# EAGLE schematic AVRI2CIO_V0_2_LEVEL0 (EAGLE 6.5.0)
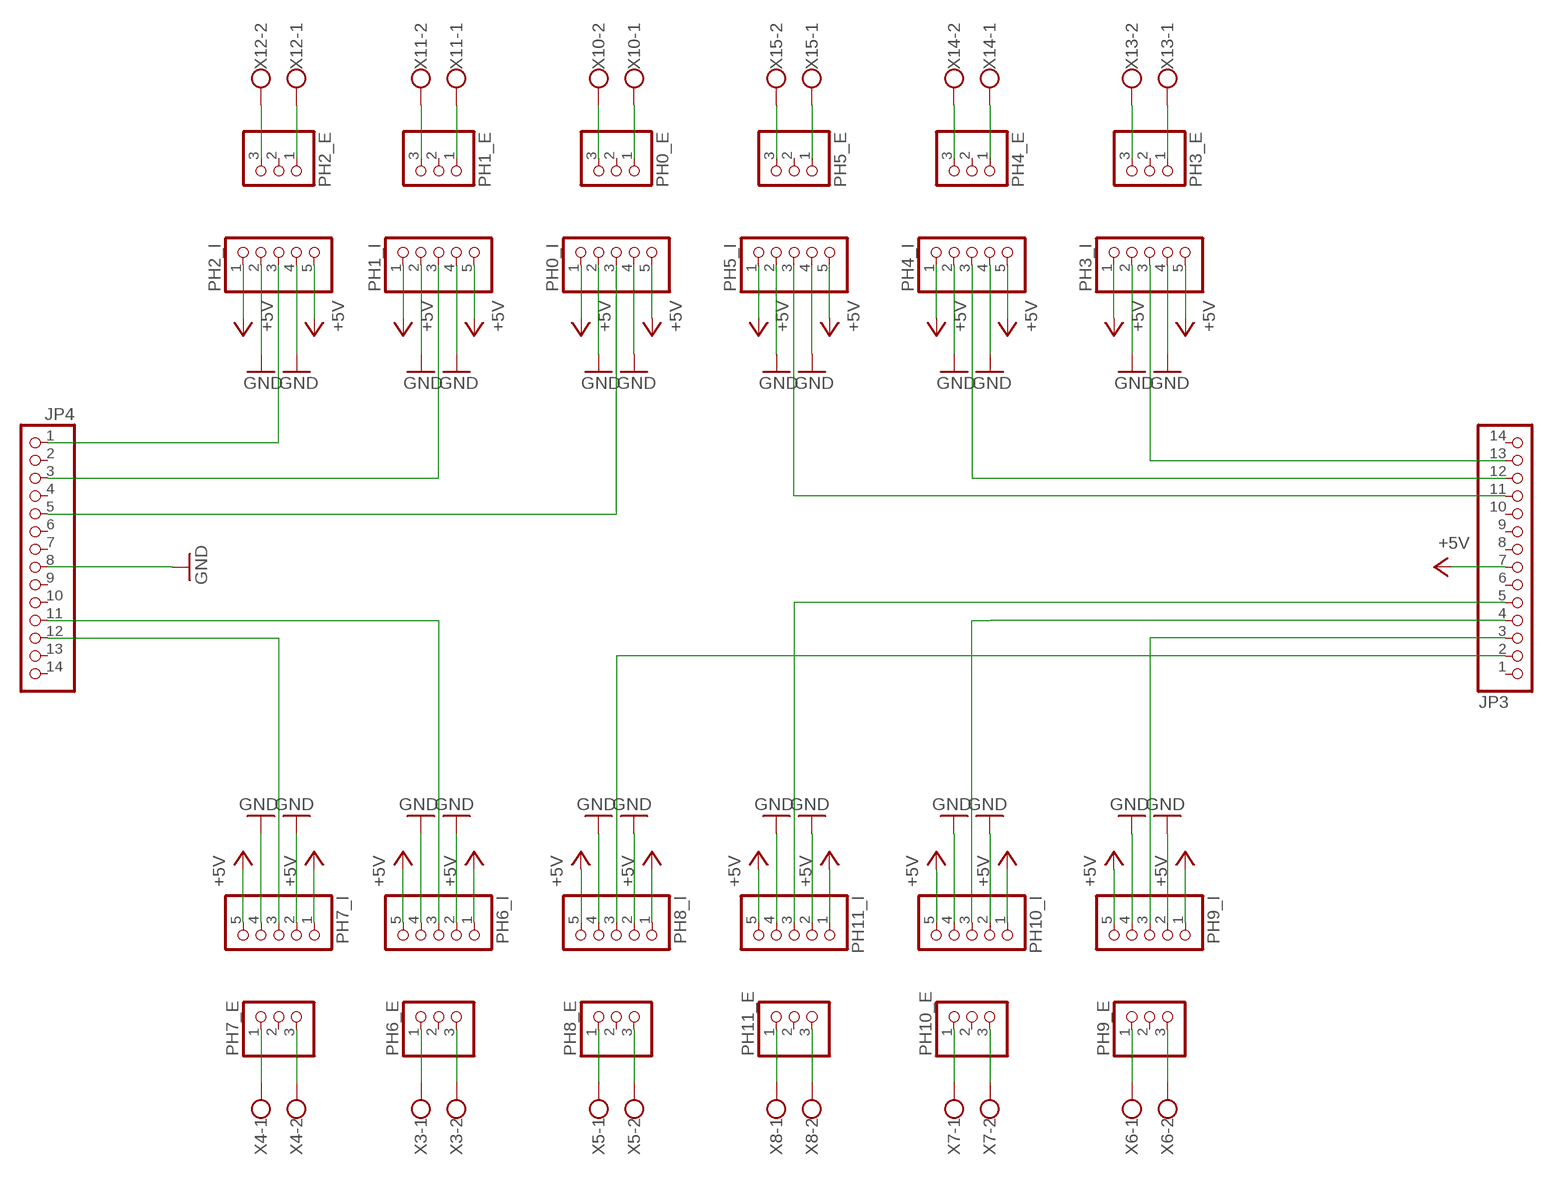
[diagram p0: schematic, sheet 1]

## Parts
JP3  PINHD-1X14  [1X14]
JP4  PINHD-1X14  [1X14]
PH0_E  PINHD-1X3  [1X03]
PH0_I  PINHD-1X5  [1X05]
PH1_E  PINHD-1X3  [1X03]
PH1_I  PINHD-1X5  [1X05]
PH2_E  PINHD-1X3  [1X03]
PH2_I  PINHD-1X5  [1X05]
PH3_E  PINHD-1X3  [1X03]
PH3_I  PINHD-1X5  [1X05]
PH4_E  PINHD-1X3  [1X03]
PH4_I  PINHD-1X5  [1X05]
PH5_E  PINHD-1X3  [1X03]
PH5_I  PINHD-1X5  [1X05]
PH6_E  PINHD-1X3  [1X03]
PH6_I  PINHD-1X5  [1X05]
PH7_E  PINHD-1X3  [1X03]
PH7_I  PINHD-1X5  [1X05]
PH8_E  PINHD-1X3  [1X03]
PH8_I  PINHD-1X5  [1X05]
PH9_E  PINHD-1X3  [1X03]
PH9_I  PINHD-1X5  [1X05]
PH10_E  PINHD-1X3  [1X03]
PH10_I  PINHD-1X5  [1X05]
PH11_E  PINHD-1X3  [1X03]
PH11_I  PINHD-1X5  [1X05]
X3  W237-102  [W237-102]
X4  W237-102  [W237-102]
X5  W237-102  [W237-102]
X6  W237-102  [W237-102]
X7  W237-102  [W237-102]
X8  W237-102  [W237-102]
X10  W237-102  [W237-102]
X11  W237-102  [W237-102]
X12  W237-102  [W237-102]
X13  W237-102  [W237-102]
X14  W237-102  [W237-102]
X15  W237-102  [W237-102]

## Nets
+5V: JP3.7 PH0_I.1 PH0_I.5 PH1_I.1 PH1_I.5 PH2_I.1 PH2_I.5 PH3_I.1 PH3_I.5 PH4_I.1 PH4_I.5 PH5_I.1 PH5_I.5 PH6_I.1 PH6_I.5 PH7_I.1 PH7_I.5 PH8_I.1 PH8_I.5 PH9_I.1 PH9_I.5 PH10_I.1 PH10_I.5 PH11_I.1 PH11_I.5
GND: JP4.8 PH0_I.2 PH0_I.4 PH1_I.2 PH1_I.4 PH2_I.2 PH2_I.4 PH3_I.2 PH3_I.4 PH4_I.2 PH4_I.4 PH5_I.2 PH5_I.4 PH6_I.2 PH6_I.4 PH7_I.2 PH7_I.4 PH8_I.2 PH8_I.4 PH9_I.2 PH9_I.4 PH10_I.2 PH10_I.4 PH11_I.2 PH11_I.4
N$1: PH0_E.3 X10.2
N$2: PH0_E.1 X10.1
N$3: PH6_E.3 X3.2
N$4: PH6_E.1 X3.1
N$5: PH7_E.3 X4.2
N$6: PH7_E.1 X4.1
N$7: PH8_E.3 X5.2
N$8: PH8_E.1 X5.1
N$9: PH9_E.3 X6.2
N$10: PH9_E.1 X6.1
N$11: PH10_E.3 X7.2
N$12: PH10_E.1 X7.1
N$13: PH11_E.3 X8.2
N$14: PH11_E.1 X8.1
N$16: JP4.12 PH7_I.3
N$17: JP3.11 PH5_I.3
N$18: JP3.3 PH9_I.3
N$19: PH1_E.1 X11.1
N$20: PH1_E.3 X11.2
N$21: JP3.2 PH8_I.3
N$22: JP3.13 PH3_I.3
N$23: PH2_E.1 X12.1
N$24: PH2_E.3 X12.2
N$25: PH3_E.1 X13.1
N$26: PH3_E.3 X13.2
N$27: PH4_E.1 X14.1
N$28: PH4_E.3 X14.2
N$29: PH5_E.1 X15.1
N$30: PH5_E.3 X15.2
N$31: JP3.12 PH4_I.3
N$32: JP4.3 PH1_I.3
N$34: JP4.11 PH6_I.3
N$35: JP4.5 PH0_I.3
N$36: JP4.1 PH2_I.3
PD3: JP3.4 PH10_I.3
PD5: JP3.5 PH11_I.3
Unconnected: JP3.1 JP3.6 JP3.8 JP3.9 JP3.10 JP3.14 JP4.2 JP4.4 JP4.6 JP4.7 JP4.9 JP4.10 JP4.13 JP4.14 PH0_E.2 PH1_E.2 PH2_E.2 PH3_E.2 PH4_E.2 PH5_E.2 PH6_E.2 PH7_E.2 PH8_E.2 PH9_E.2 PH10_E.2 PH11_E.2

## Library data of the parts
JP3 JP4 = pinhead:PINHD-1X14: PIN HEADER
PH0_E PH1_E PH2_E PH3_E PH4_E PH5_E PH6_E PH7_E PH8_E PH9_E PH10_E PH11_E = pinhead:PINHD-1X3: PIN HEADER
PH0_I PH1_I PH2_I PH3_I PH4_I PH5_I PH6_I PH7_I PH8_I PH9_I PH10_I PH11_I = pinhead:PINHD-1X5: PIN HEADER
X3-X8 X10-X15 = con-wago-500:W237-102: WAGO SCREW CLAMP; MPN: 237-102; OC_FARNELL: unknown; OC_NEWARK: 70K9898